# EAGLE design voltage_difference_detector (EAGLE 7.6.0)
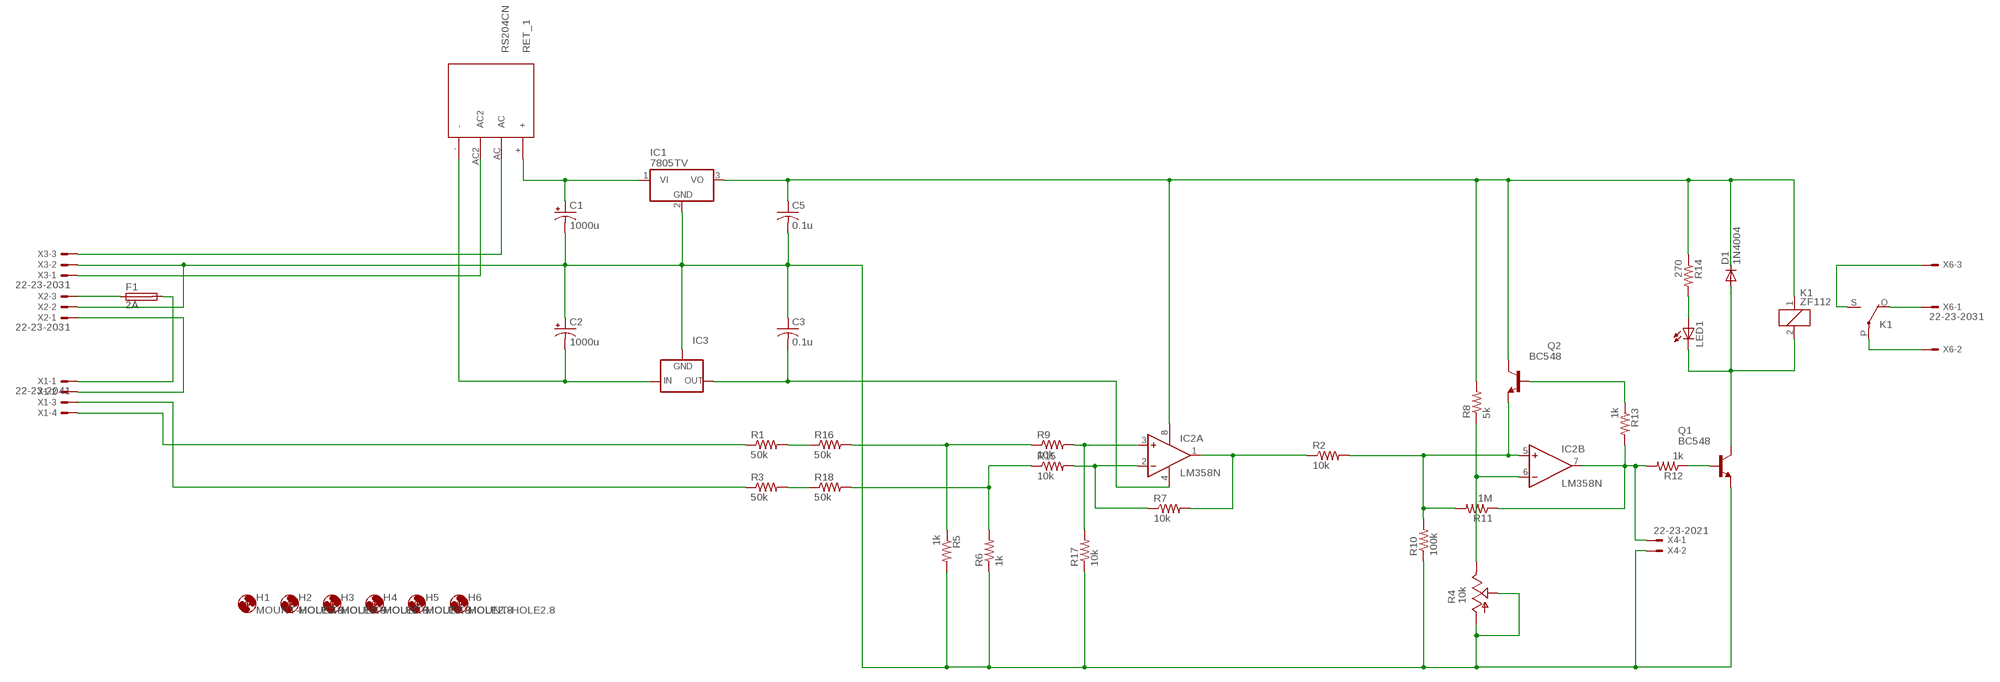
[diagram p0: schematic, sheet 1]

## Parts
C1  1000u  CPOL-USE5-10.5  [E5-10,5]
C2  1000u  CPOL-USE5-10.5  [E5-10,5]
C3  0.1u  C-US050-024X044  [C050-024X044]
C5  0.1u  C-US050-024X044  [C050-024X044]
D1  1N4004  [DO41-10]
F1  2A  SH22,5  [SH22,5]
H1  MOUNT-HOLE2.8  [2,8]
H2  MOUNT-HOLE2.8  [2,8]
H3  MOUNT-HOLE2.8  [2,8]
H4  MOUNT-HOLE2.8  [2,8]
H5  MOUNT-HOLE2.8  [2,8]
H6  MOUNT-HOLE2.8  [2,8]
IC1  7805TV  [TO220V]
IC2  LM358N  [DIL08]
IC3  79XXS  [79XXS]
K1  ZF112  [ZF112]
LED1  LED3MM  [LED3MM]
Q1  BC548  [TO92-EBC]
Q2  BC548  [TO92-EBC]
R1  50k  R-US_0204/7  [0204/7]
R2  10k  R-US_0204/7  [0204/7]
R3  50k  R-US_0204/7  [0204/7]
R4  10k  TRIM_US-RJ9W  [RJ9W]
R5  1k  R-US_0204/7  [0204/7]
R6  1k  R-US_0204/7  [0204/7]
R7  10k  R-US_0204/7  [0204/7]
R8  5k  R-US_0204/7  [0204/7]
R9  10k  R-US_0204/7  [0204/7]
R10  100k  R-US_0204/7  [0204/7]
R11  1M  R-US_0204/7  [0204/7]
R12  1k  R-US_0204/7  [0204/7]
R13  1k  R-US_0204/7  [0204/7]
R14  270  R-US_0204/7  [0204/7]
R15  10k  R-US_0204/7  [0204/7]
R16  50k  R-US_0204/7  [0204/7]
R17  10k  R-US_0204/7  [0204/7]
R18  50k  R-US_0204/7  [0204/7]
RET_1  RS204CN  [SIP]
X1  22-23-2041  [22-23-2041]
X2  22-23-2031  [22-23-2031]
X3  22-23-2031  [22-23-2031]
X4  22-23-2021  [22-23-2021]
X6  22-23-2031  [22-23-2031]

## Nets
GND: C1.- C2.+ C3.1 C5.2 IC1.2(GND) IC3.GND Q1.E R4.A R4.S R5.2 R6.1 R10.1 R17.1 X2.2 X3.2 X4.2
N$1: C2.- IC3.IN RET_1.-
N$2: IC2.5(B:+IN) Q2.E R2.2 R10.2 R11.2
N$3: IC2.1(A:OUT) R2.1 R7.2
N$5: RET_1.AC X3.3
N$6: R5.1 R9.1 R16.2
N$7: F1.2 X1.1
N$8: C1.+ IC1.1(VI) RET_1.+
N$9: R1.2 R16.1
N$10: IC2.2(A:-IN) R7.1 R15.2
N$11: IC2.6(B:-IN) R4.E R8.1
N$12: IC2.7(B:OUT) R11.1 R12.2 R13.2 X4.1
N$13: Q1.B R12.1
N$14: Q2.B R13.1
N$15: R6.2 R15.1 R18.2
N$16: D1.A K1.2 LED1.K(C) Q1.C
N$17: R1.1 X1.4
N$18: R3.1 X1.3
N$19: RET_1.AC2 X3.1
N$20: C3.2 IC2.4(P:V-) IC3.OUT
N$21: R3.2 R18.1
N$22: LED1.A R14.2
N$23: X1.2 X2.1
N$24: K1.O(2:O) X6.1
N$25: K1.P(2:P) X6.2
N$27: K1.S(2:S) X6.3
N$28: IC2.3(A:+IN) R9.2 R17.2
N$33: F1.1 X2.3
VCC: C5.1 D1.C IC1.3(VO) IC2.8(P:V+) K1.1 Q2.C R8.2 R14.1

## Library data of the parts
C1 C2 = rcl:CPOL-US: POLARIZED CAPACITOR, American symbol
C3 C5 = rcl:C-US: CAPACITOR, American symbol
D1 = diode:1N4004: DIODE general purpose rectifier, 1 A
F1 = fuse_guilherme:SH22,5: FUSE HOLDER grid 22,5 mm, OGN0031 8201, Schurter (Buerklin); MF: SCHURTER; MPN: 0031.8201; OC_FARNELL: 1162740; OC_NEWARK: 96F8317
H1-H6 = holes:MOUNT-HOLE: MOUNTING HOLE with drill center marker
IC1 = linear:78*: Positive VOLTAGE REGULATOR Source: http://cache.national.com/ds/LM/LM78L05.pdf http://www.fairchildsemi.com/ds/LM/LM7805.pdf
IC2 = linear:LM358: OP AMP also LM158; LM258; LM2904 Source: http://cache.national.com/ds/LM/LM158.pdf
IC3 = v-reg:79XXS: VOLTAGE REGULATOR
K1 = relay:ZF112: RELAY 1 x switch; OC_FARNELL: unknown; OC_NEWARK: unknown
LED1 = led:LED: LED OSRAM: - CHIPLED LG R971, LG N971, LY N971, LG Q971, LY Q971, LO R971, LY R971 LH N974, LH R974 LS Q976, LO Q976, LY Q976 LO Q996 - Hyper CHIPLED LW Q18S LB Q993, LB Q99A, LB R99A - SideLED LS A670, LO A670, LY A670, LG A670, LP A670 LB A673, LV A673, LT A673, LW A673 LH A674 LY A675 LS A676, LA A676, LO A676, LY A676, LW A676 LS A679, LY A679, LG A679 - Hyper Micro SIDELED® LS Y876, LA Y876, LO Y876, LY Y876 LT Y87S - SmartLED LW L88C, LW L88S LB L89C, LB L89S, LG L890 LS L89K, LO L89K, LY L89K LS L896, LA L896, LO L896, LY L896 - TOPLED LS T670, LO T670, LY T670, LG T670, LP T670 LSG T670, LSP T670, LSY T670, LOP T670, LYG T670 LG T671, LOG T671, LSG T671 LB T673, LV T673, LT T673, LW T673 LH T674 LS T676, LA T676, LO T676, LY T676, LB T676, LH T676, LSB T676, LW T676 LB T67C, LV T67C, LT T67C, LS T67K, LO T67K, LY T67K, LW E67C LS E67B, LA E67B, LO E67B, LY E67B, LB E67C, LV E67C, LT E67C LW T67C LS T679, LY T679, LG T679 LS T770, LO T770, LY T770, LG T770, LP T770 LB T773, LV T773, LT T773, LW T773 LH T774 LS E675, LA E675, LY E675, LS T675 LS T776, LA T776, LO T776, LY T776, LB T776 LHGB T686 LT T68C, LB T68C - Hyper Mini TOPLED® LB M676 - Mini TOPLED Santana® LG M470 LS M47K, LO M47K, LY M47K Source: http://www.osram.convergy.de LUXEON: - LUMILED® LXK2-PW12-R00, LXK2-PW12-S00, LXK2-PW14-U00, LXK2-PW14-V00 LXK2-PM12-R00, LXK2-PM12-S00, LXK2-PM14-U00 LXK2-PE12-Q00, LXK2-PE12-R00, LXK2-PE12-S00, LXK2-PE14-T00, LXK2-PE14-U00 LXK2-PB12-K00, LXK2-PB12-L00, LXK2-PB12-M00, LXK2-PB14-N00, LXK2-PB14-P00, LXK2-PB14-Q00 LXK2-PR12-L00, LXK2-PR12-M00, LXK2-PR14-Q00, LXK2-PR14-R00 LXK2-PD12-Q00, LXK2-PD12-R00, LXK2-PD12-S00 LXK2-PH12-R00, LXK2-PH12-S00 LXK2-PL12-P00, LXK2-PL12-Q00, LXK2-PL12-R00 Source: www.luxeon.com KINGBRIGHT: KA-3528ASYC Source: www.kingbright.com
Q1 Q2 = transistor-npn:BC548*: NPN Transistor
R1-R3 R5-R18 = rcl:R-US_: RESISTOR, American symbol
R4 = pot:TRIM_US-: POTENTIOMETER
RET_1 = minha-lib:RS204
X1 = con-molex:22-23-2041: .100" (2.54mm) Center Header - 4 Pin; MF: MOLEX; MPN: 22-23-2041; OC_FARNELL: 1462920; OC_NEWARK: 38C0355
X2 X3 X6 = con-molex:22-23-2031: .100" (2.54mm) Center Header - 3 Pin; MF: MOLEX; MPN: 22-23-2031; OC_FARNELL: 1462950; OC_NEWARK: 30C0862
X4 = con-molex:22-23-2021: .100" (2.54mm) Center Header - 2 Pin; MF: MOLEX; MPN: 22-23-2021; OC_FARNELL: 1462926; OC_NEWARK: 25C3832

## Board
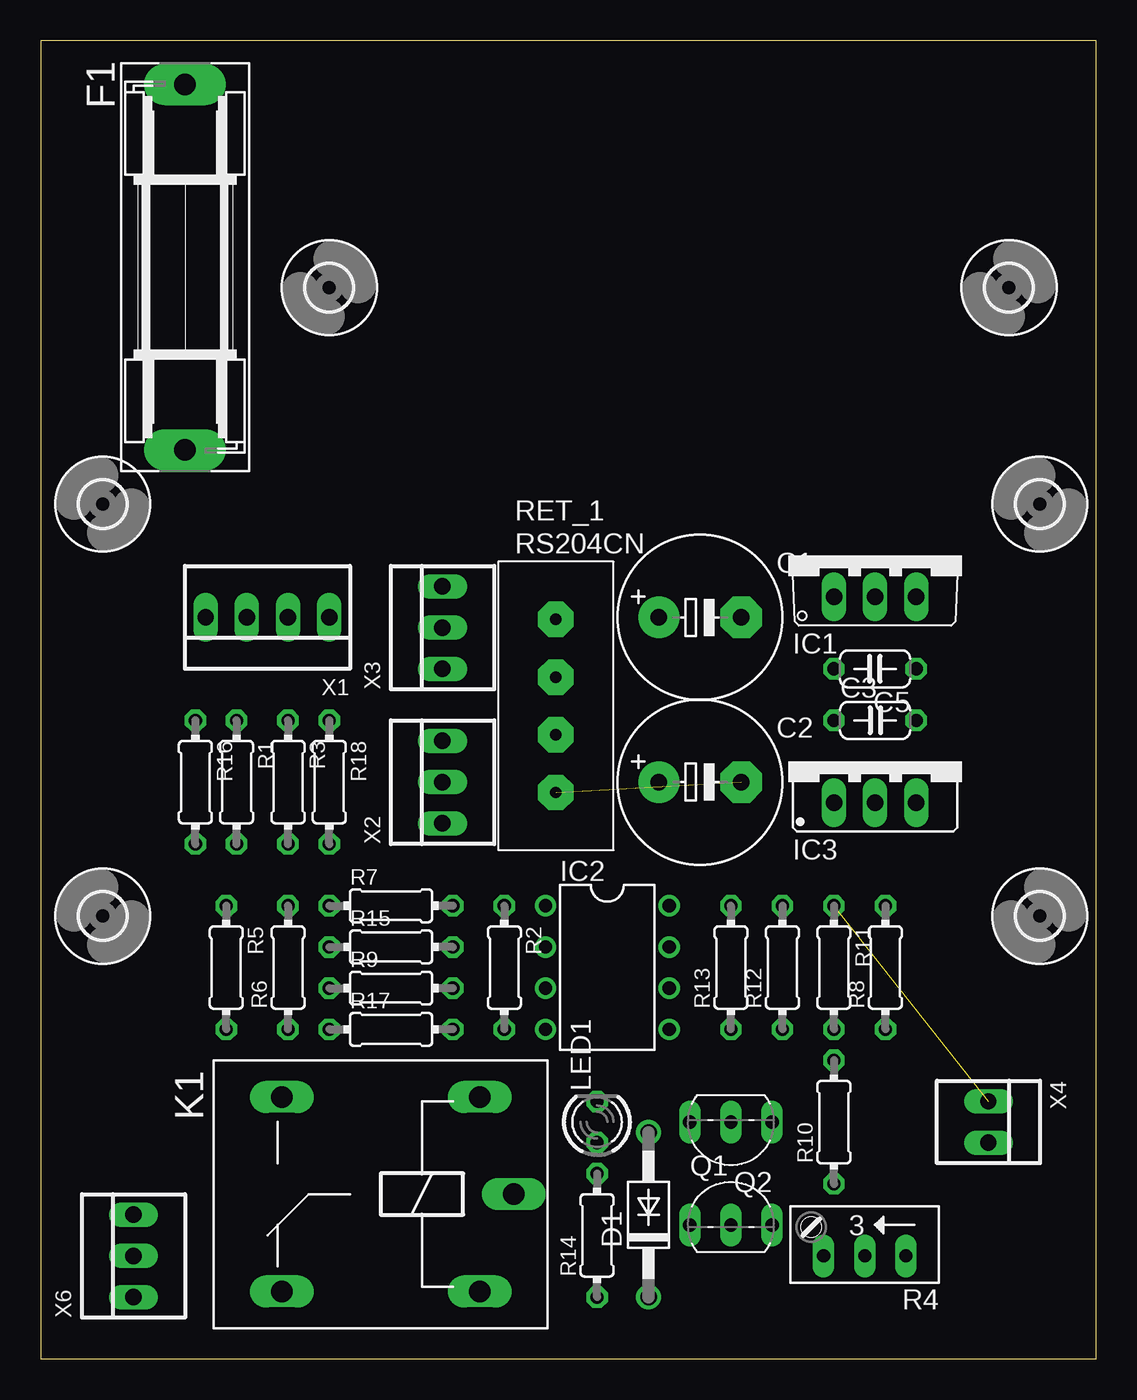
[diagram p1: board, top side]
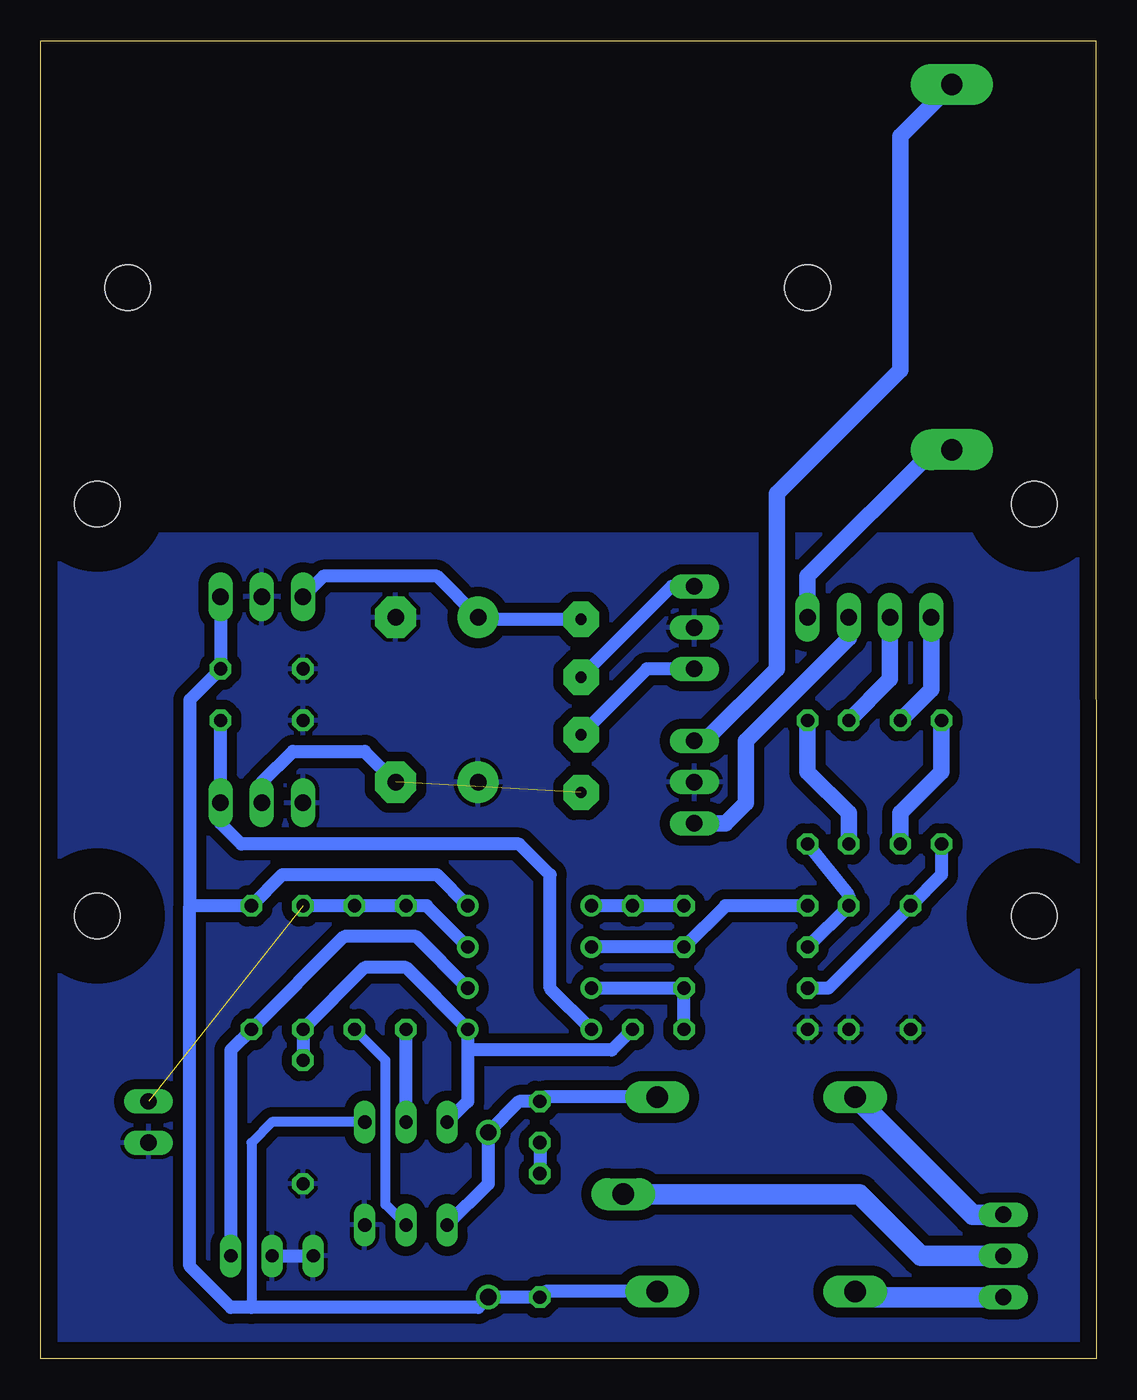
[diagram p2: board, bottom side, seen from below]

Size 65.09 x 81.28 mm. Coordinates in mm from the lower left corner, seen from the top.
Outline: 65.09,81.28 0.02,81.28 0,0 65.09,0.02 65.09,81.28
Copper layers (1*16): Top 0.035mm / dielectric 1.5mm / Bottom 0.035mm
Design rules "default": minimum track width 10mil, minimum drill 24mil, track to track 8mil, track to pad 8mil, pad to pad 8mil, via to via 8mil, smd to smd 8mil, copper to edge 40mil, drill to drill 8mil, minimum pad ring 10mil, minimum via ring 8mil, stop-mask expansion 4mil, vias tented up to drill 0mil, thermal gap 10mil

### Footprints (pad centres in the part's own frame; a part is rotated, then mirrored left to right if it is on the bottom)
E5-10,5 = drill 1.016 pad 2.54: + -2.54,0 | drill 1.016 pad 2.54 octagon: - 2.54,0
C050-024X044 = drill 0.813 octagon: 1 -2.54,0; 2 2.54,0
DO41-10 = drill 1.016: A 5.08,0; C -5.08,0
SH22,5 = drill 1.321 pad 2.54 long: 1 -11.252,0; 2 11.252,0
2,8 = hole 2.8: 0,0
TO220V = drill 1.016 long: 1 -2.54,-2.54; 2 0,-2.54; 3 2.54,-2.54
DIL08 = drill 0.813 pad 1.27: 1 -3.81,-3.81; 2 -1.27,-3.81; 3 1.27,-3.81; 4 3.81,-3.81; 5 3.81,3.81; 6 1.27,3.81; 7 -1.27,3.81; 8 -3.81,3.81
79XXS = drill 1.016 long: GND -2.54,-2.54; IN 0,-2.54; OUT 2.54,-2.54
ZF112 = drill 1.321 long: 1 -6.096,5.994; 2 -6.096,-5.994; O 6.096,5.994; P -8.204,0; S 6.096,-5.994
LED3MM = drill 0.813 octagon: A -1.27,0; K 1.27,0
TO92-EBC = drill 0.813 long: B 0,-1.27; C -2.54,-1.27; E 2.54,-1.27
0204/7 = drill 0.813 octagon: 1 -3.81,0; 2 3.81,0
RJ9W = drill 0.813 long: A 2.54,0.635; E -2.54,0.635; S 0,0.635
SIP = drill 0.7 pad 2.184 octagon: + 0,0.508; - 0,-10.16; AC 0,-3.048; AC2 0,-6.604
22-23-2041 = drill 1.016 long: 1 -3.81,0; 2 -1.27,0; 3 1.27,0; 4 3.81,0
22-23-2031 = drill 1.016 long: 1 -2.54,0; 2 0,0; 3 2.54,0
22-23-2021 = drill 1 long: 1 -1.27,0; 2 1.27,0

### Placement (x,y rotation side)
C1  40.66,45.72 0 top
C2  40.66,35.56 0 top
C3  51.46,39.37 0 top
C5  51.46,42.55 180 top
D1  37.49,8.89 90 top
F1  8.91,67.31 270 top
H1  3.83,27.3 270 top
H2  61.62,27.3 0 top
H3  3.83,52.7 270 top
H4  61.62,52.7 270 top
H5  17.8,66.04 0 top
H6  59.71,66.04 0 top
IC1  51.46,49.53 0 top
IC2  34.95,24.13 270 top
IC3  51.46,36.83 0 top
K1  20.97,10.16 180 top
LED1  34.31,14.61 90 top
Q1  42.57,9.53 0 top
Q2  42.57,13.34 180 top
R1  12.08,35.56 270 top
R2  28.59,24.13 270 top
R3  15.26,35.56 270 top
R4  50.82,6.99 180 top
R5  11.45,24.13 270 top
R6  15.26,24.13 90 top
R7  21.61,27.94 0 top
R8  52.09,24.13 90 top
R9  21.61,22.86 0 top
R10  48.92,14.61 90 top
R11  48.92,24.13 270 top
R12  45.74,24.13 90 top
R13  42.57,24.13 90 top
R14  34.31,7.62 90 top
R15  21.61,25.4 0 top
R16  9.54,35.56 270 top
R17  21.61,20.32 0 top
R18  17.8,35.56 270 top
RET_1  31.77,45.09 0 top
X1  13.99,45.72 180 top
X2  24.79,35.56 90 top
X3  24.79,45.09 90 top
X4  58.44,14.61 270 top
X6  5.73,6.35 90 top

### Tracks (layer width: path | path; a pad name or v marks a point on that pad's centre or on a via)
GND
  Bottom 0.813: R4.S R4.A
  pour Bottom (isolate 0.61): 0.66,0.64 0.66,50.8 64.16,50.8 64.16,0.64
N$1  (1 unrouted)
  Bottom 0.813: IC3.IN 51.46,35.56 49.55,37.47 45.11,37.47 C2.-
N$2
  Bottom 0.813: R2.2 29.86,19.05 38.76,19.05 | 38.76,19.05 IC2.5 42.57,24.13 45.11,24.13 R11.2 R10.2 | 38.76,19.05 38.76,15.88 Q2.E
N$3
  Bottom 0.813: R2.1 R7.2 IC2.1
N$5
  Bottom 0.813: X3.3 26.18,47.62 RET_1.AC
N$6
  Bottom 0.813: R9.1 16.53,22.86 R5.1 9.54,29.84 R16.2
N$7
  Bottom 1.016: F1.2 10,56.06 17.8,48.26 X1.1
N$8
  Bottom 0.813: IC1.1 47.65,48.26 40.66,48.26 C1.+ 37.99,45.59 RET_1.+
N$9
  Bottom 1.016: R16.1 9.54,36.2 12.08,33.66 R1.2
N$10
  Bottom 0.813: IC2.2 R15.2 22.88,27.94 R7.1
N$11
  Bottom 0.813: IC2.6 41.93,26.04 46.38,26.04 R8.1 53.36,19.05 R4.E
N$12  (1 unrouted)
  Bottom 0.813: IC2.7 41.3,27.94 R13.2 R12.2 R11.1
N$13
  Bottom 0.61: Q1.B 43.84,9.53 43.84,18.41 R12.1
N$14
  Bottom 0.813: Q2.B R13.1
N$15
  Bottom 0.813: R15.1 R6.2 15.26,28.57 R18.2
N$16
  Bottom 0.813: Q1.C 37.49,10.79 D1.A 35.58,15.88 LED1.K 34.03,16.15 K1.2
N$17
  Bottom 1.016: X1.4 10.18,41.27 R1.1
N$18
  Bottom 1.016: X1.3 12.72,41.91 R3.1
N$19
  Bottom 0.813: X3.1 27.71,42.55 RET_1.AC2
N$20
  Bottom 0.813: IC2.4 33.68,22.86 33.68,29.84 35.58,31.75 52.73,31.75 54,33.02 IC3.OUT C3.2
N$21
  Bottom 1.016: R18.1 17.8,36.2 15.26,33.66 R3.2
N$22
  Bottom 0.813: LED1.A R14.2
N$23
  Bottom 1.016: X1.2 15.26,44.45 21.61,38.1 21.61,34.29 22.88,33.02 X2.1
N$24
  Bottom 1.27: X6.1 14.52,3.81 K1.O
N$25
  Bottom 1.27: X6.2 10.81,6.35 14.62,10.16 K1.P
N$27
  Bottom 1.27: X6.3 7.61,8.89 K1.S
N$28
  Bottom 0.813: IC2.3 R9.2 R17.2
N$33
  Bottom 1.016: F1.1 12.08,75.39 12.08,60.96 19.7,53.34 19.7,42.55 24.15,38.1 X2.3
VCC
  Bottom 0.61: Q2.C 50.82,14.61 52.09,13.34 52.09,3.17
  Bottom 0.813: K1.1 33.95,4.17 R14.1 D1.C 38.12,3.17 52.09,3.17 53.36,3.17 55.9,5.71 55.9,27.94 | IC2.8 40.66,29.84 50.19,29.84 R8.2 55.9,27.94 | IC1.3 C5.1 55.9,40.64 55.9,27.94